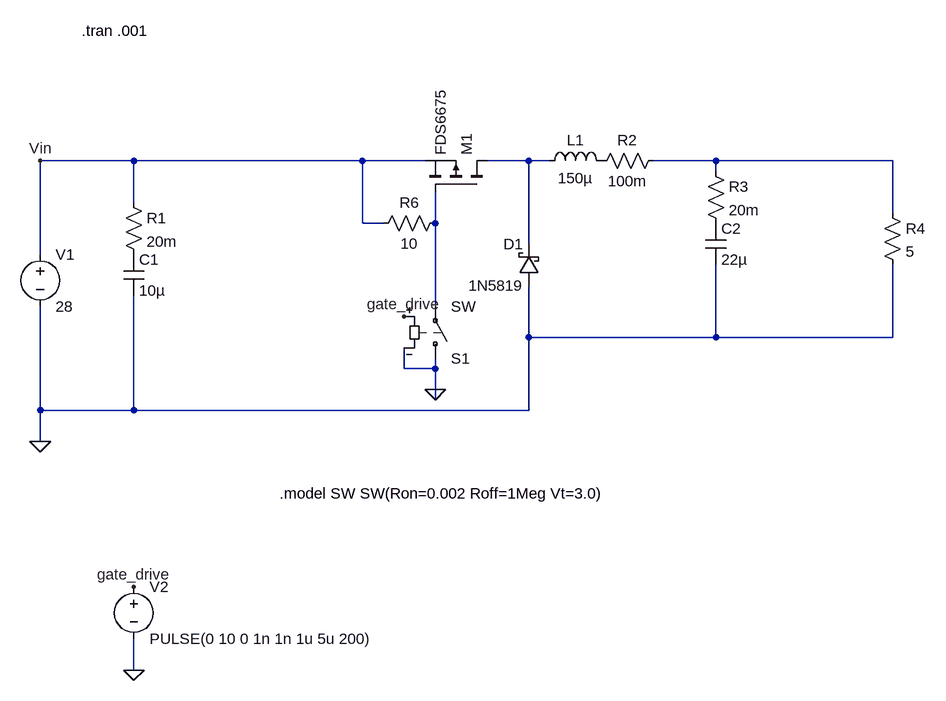
[diagram p0: schematic buck_sch_2019_08_07.asc]
buck_sch_2019_08_07.asc, the LTspice schematic file:
Version 4
SHEET 1 1208 856
WIRE -16 -16 -160 -16
WIRE 336 -16 -16 -16
WIRE 432 -16 336 -16
WIRE 592 -16 528 -16
WIRE 624 -16 592 -16
WIRE 880 -16 784 -16
WIRE 1152 -16 880 -16
WIRE 880 0 880 -16
WIRE -16 48 -16 -16
WIRE 1152 64 1152 -16
WIRE 336 80 336 -16
WIRE 368 80 336 80
WIRE 448 80 448 32
WIRE 592 112 592 -16
WIRE -160 128 -160 -16
WIRE 448 208 448 80
WIRE 592 256 592 176
WIRE 880 256 880 144
WIRE 880 256 592 256
WIRE 1152 256 1152 144
WIRE 1152 256 880 256
WIRE 400 304 400 272
WIRE 448 304 448 288
WIRE 448 304 400 304
WIRE 448 336 448 304
WIRE 448 352 448 336
WIRE -160 368 -160 208
WIRE -16 368 -16 192
WIRE -16 368 -160 368
WIRE 592 368 592 256
WIRE 592 368 -16 368
WIRE -160 416 -160 368
WIRE -16 768 -16 720
FLAG -160 416 0
FLAG -160 -16 Vin
FLAG -16 768 0
FLAG 448 336 0
FLAG -16 640 gate_drive
FLAG 400 224 gate_drive
SYMBOL voltage -160 112 R0
WINDOW 123 0 0 Left 2
WINDOW 39 0 0 Left 2
SYMATTR InstName V1
SYMATTR Value 28
SYMBOL cap -32 128 R0
SYMATTR InstName C1
SYMATTR Value 10µ
SYMBOL res -32 32 R0
SYMATTR InstName R1
SYMATTR Value 20m
SYMBOL ind 608 0 R270
WINDOW 0 32 56 VTop 2
WINDOW 3 5 56 VBottom 2
SYMATTR InstName L1
SYMATTR Value 150µ
SYMBOL schottky 608 176 R180
WINDOW 0 24 64 Left 2
WINDOW 3 24 0 Left 2
SYMATTR InstName D1
SYMATTR Value 1N5819
SYMATTR Description Diode
SYMATTR Type diode
SYMBOL cap 864 80 R0
SYMATTR InstName C2
SYMATTR Value 22µ
SYMBOL res 800 -32 R90
WINDOW 0 0 56 VBottom 2
WINDOW 3 32 56 VTop 2
SYMATTR InstName R2
SYMATTR Value 100m
SYMBOL res 864 -16 R0
SYMATTR InstName R3
SYMATTR Value 20m
SYMBOL res 1136 48 R0
SYMATTR InstName R4
SYMATTR Value 5
SYMBOL voltage -16 624 R0
WINDOW 123 0 0 Left 2
WINDOW 39 0 0 Left 2
SYMATTR InstName V2
SYMATTR Value PULSE(0 10 0 1n 1n 1u 5u 200)
SYMBOL pmos 528 32 M270
SYMATTR InstName M1
SYMATTR Value FDS6675
SYMBOL res 464 64 R90
WINDOW 0 0 56 VBottom 2
WINDOW 3 32 56 VTop 2
SYMATTR InstName R6
SYMATTR Value 10
SYMBOL sw 448 304 M180
SYMATTR InstName S1
TEXT -96 -216 Left 2 !.tran .001
TEXT 208 496 Left 2 !.model SW SW(Ron=0.002 Roff=1Meg Vt=3.0)

The netlist it stands for:
* buck_sch_2019_08_07.asc
V1 Vin 0 28
C1 P001 0 10µ
R1 Vin P001 20m
L1 N001 P002 150µ
D1 0 N001 1N5819
C2 P003 0 22µ
R2 N002 P002 100m
R3 N002 P003 20m
R4 N002 0 5
V2 gate_drive 0 PULSE(0 10 0 1n 1n 1u 5u 200)
M1 N001 N003 Vin Vin FDS6675
R6 N003 Vin 10
S1 0 N003 gate_drive 0 SW
.model D D
.lib standard.dio
.model NMOS NMOS
.model PMOS PMOS
.lib standard.mos
.tran .001
.model SW SW(Ron=0.002 Roff=1Meg Vt=3.0)
.backanno
.end